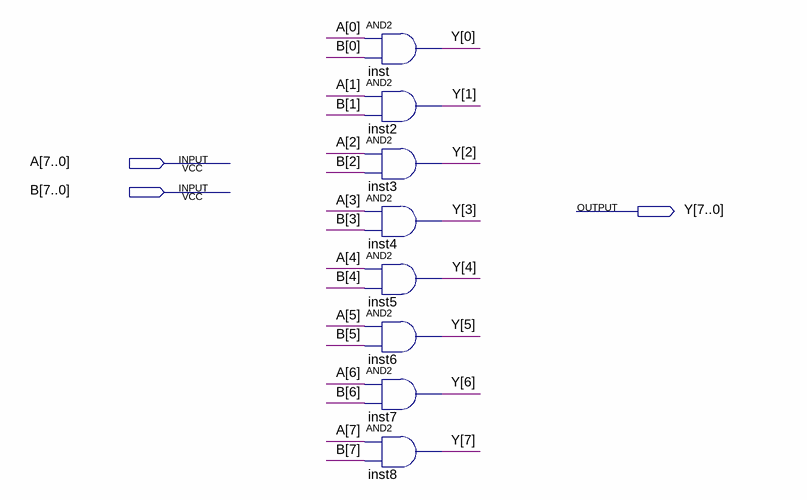
[diagram p0: schematic sheet]
// Quartus schematic and8bit.bdf as structural Verilog: 8 symbols, 3 pins
module and8bit (
  input  [7:0] A,
  input  [7:0] B,
  output [7:0] Y
);

  and inst (Y[0], A[0], B[0]);
  and inst2 (Y[1], A[1], B[1]);
  and inst3 (Y[2], A[2], B[2]);
  and inst4 (Y[3], A[3], B[3]);
  and inst5 (Y[4], A[4], B[4]);
  and inst6 (Y[5], A[5], B[5]);
  and inst7 (Y[6], A[6], B[6]);
  and inst8 (Y[7], A[7], B[7]);
endmodule
